# EAGLE design Radio Shack Drums (EAGLE 9.4.2)
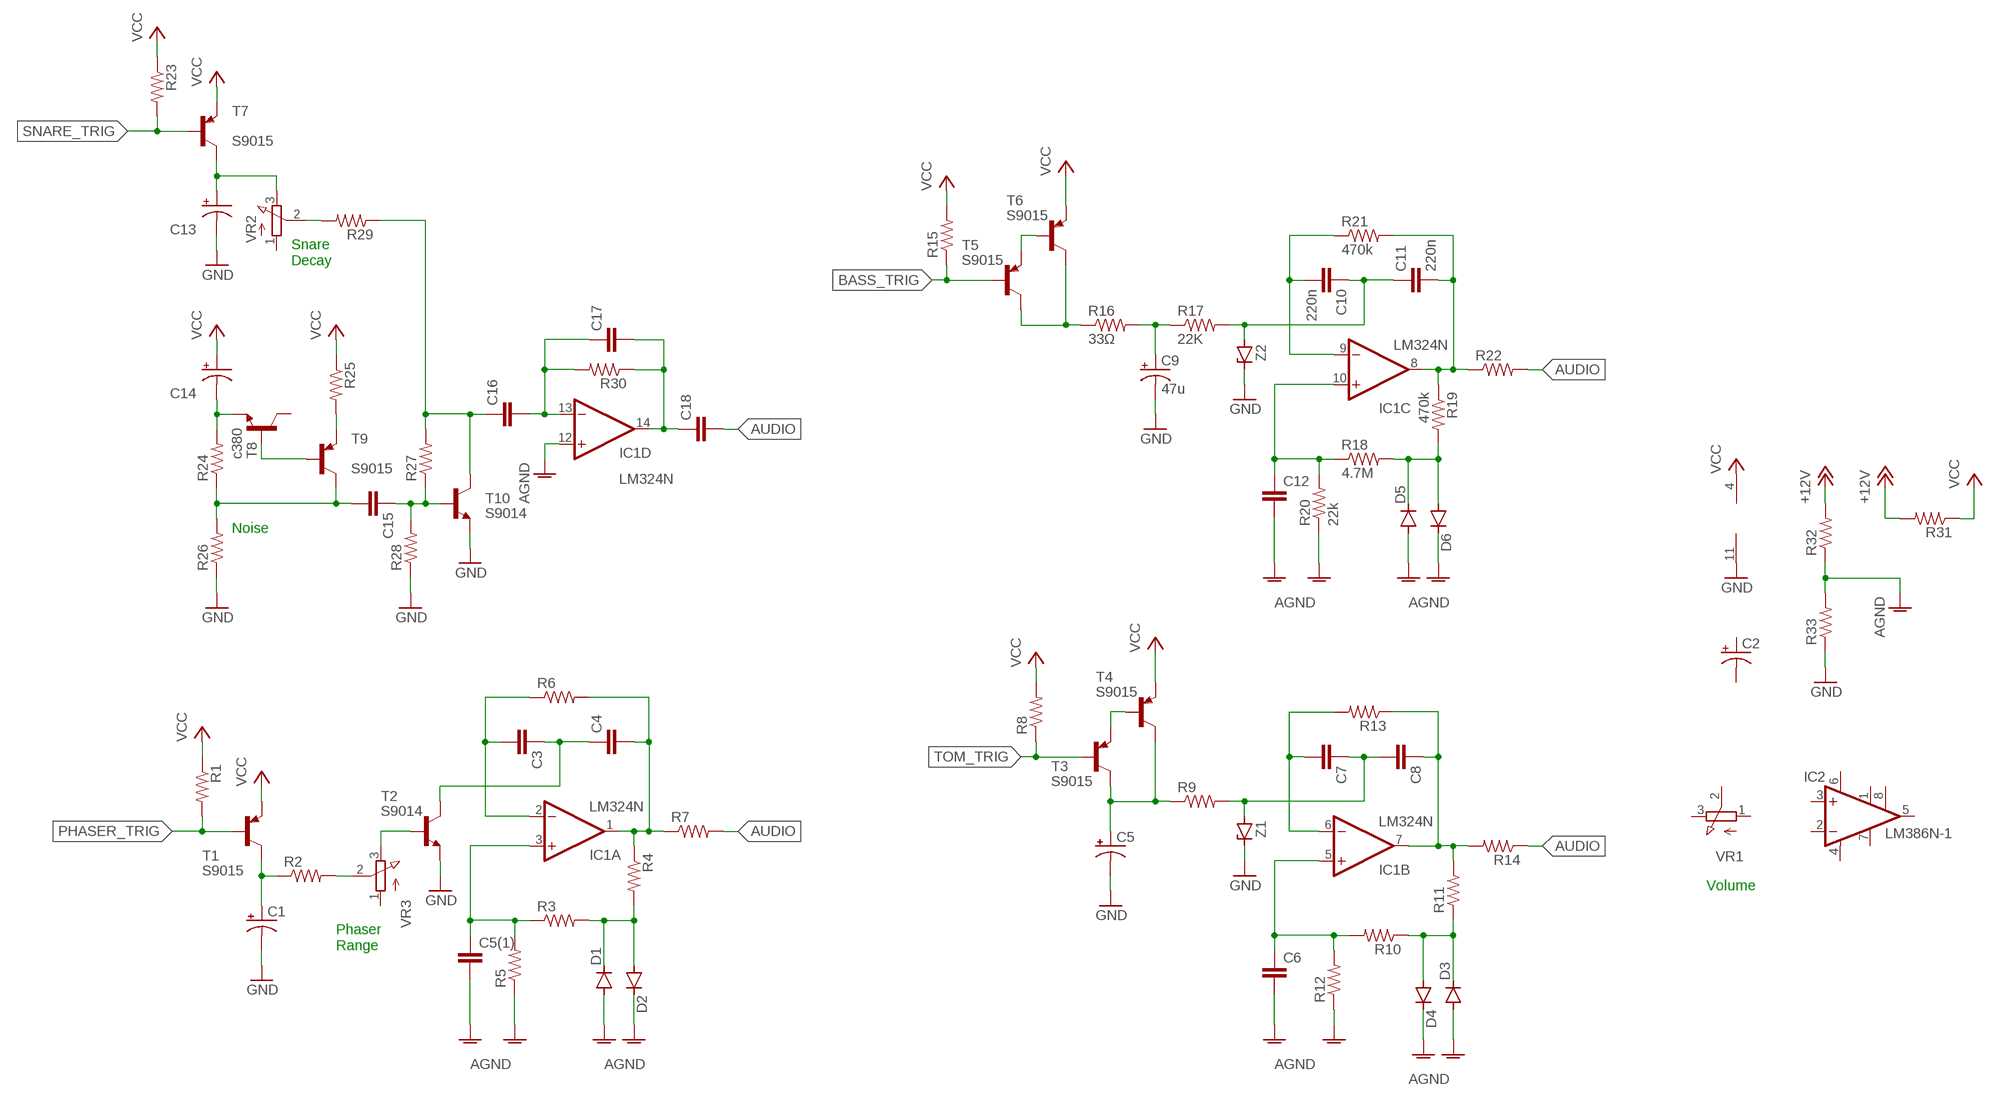
[diagram p0: schematic, sheet 1]

## Parts
C1  CPOL-USTT2D4L  [TT2D4L]
C2  CPOL-USTT2D4L  [TT2D4L]
C3  C-EU075-032X103  [C075-032X103]
C4  C-EU075-032X103  [C075-032X103]
C5  CPOL-USTT2D4L  [TT2D4L]
C5(1)  C-EU075-032X103  [C075-032X103]
C6  C-EU075-032X103  [C075-032X103]
C7  C-EU075-032X103  [C075-032X103]
C8  C-EU075-032X103  [C075-032X103]
C9  47u  CPOL-USTT2D4L  [TT2D4L]
C10  220n  C-EU075-032X103  [C075-032X103]
C11  220n  C-EU075-032X103  [C075-032X103]
C12  C-EU075-032X103  [C075-032X103]
C13  CPOL-USTT2D4L  [TT2D4L]
C14  CPOL-USTT2D4L  [TT2D4L]
C15  C-EU075-032X103  [C075-032X103]
C16  C-EU075-032X103  [C075-032X103]
C17  C-EU050-024X044  [C050-024X044]
C18  C-EU050-024X044  [C050-024X044]
D1  DIODE-D-5  [D-5]
D2  DIODE-D-5  [D-5]
D3  DIODE-D-5  [D-5]
D4  DIODE-D-5  [D-5]
D5  DIODE-D-5  [D-5]
D6  DIODE-D-5  [D-5]
IC1  LM324N  [DIL14]
IC2  LM386N-1  [DIL08]
R1  R-US_0207/10  [0207/10]
R2  R-US_0207/10  [0207/10]
R3  R-US_0207/10  [0207/10]
R4  R-US_0207/10  [0207/10]
R5  R-US_0207/10  [0207/10]
R6  R-US_0207/10  [0207/10]
R7  R-US_0207/10  [0207/10]
R8  R-US_0207/10  [0207/10]
R9  R-US_0207/10  [0207/10]
R10  R-US_0207/10  [0207/10]
R11  R-US_0207/10  [0207/10]
R12  R-US_0207/10  [0207/10]
R13  R-US_0207/10  [0207/10]
R14  R-US_0207/10  [0207/10]
R15  R-US_0207/10  [0207/10]
R16  33Ω  R-US_0207/10  [0207/10]
R17  22K  R-US_0207/10  [0207/10]
R18  4.7M  R-US_0207/10  [0207/10]
R19  470k  R-US_0207/10  [0207/10]
R20  22k  R-US_0207/10  [0207/10]
R21  470k  R-US_0207/10  [0207/10]
R22  R-US_0207/10  [0207/10]
R23  R-US_0207/10  [0207/10]
R24  R-US_0207/10  [0207/10]
R25  R-US_0207/10  [0207/10]
R26  R-US_0207/10  [0207/10]
R27  R-US_0207/10  [0207/10]
R28  R-US_0207/10  [0207/10]
R29  R-US_0207/10  [0207/10]
R30  R-US_0207/10  [0207/10]
R31  R-US_0207/10  [0207/10]
R32  R-US_0207/10  [0207/10]
R33  R-US_0207/10  [0207/10]
T1  S9015  -PNP-TO92  [TO92]
T2  S9014  -NPN-TO92  [TO92]
T3  S9015  -PNP-TO92  [TO92]
T4  S9015  -PNP-TO92  [TO92]
T5  S9015  -PNP-TO92  [TO92]
T6  S9015  -PNP-TO92  [TO92]
T7  S9015  -PNP-TO92  [TO92]
T8  c380  -NPN-TO92-ECB  [TO92-ECB]
T9  S9015  -PNP-TO92  [TO92]
T10  S9014  -NPN-TO92  [TO92]
VR1  3RP/1610N  [3RP/1610N]
VR2  3RP/1610N  [3RP/1610N]
VR3  3RP/1610N  [3RP/1610N]
Z1  ZENER-DIODEDO34-7  [DO34Z7]
Z2  ZENER-DIODEDO34-7  [DO34Z7]

## Nets
+12V: R31.2 R32.2
AGND: C5(1).2 C6.2 C12.2 D1.A D2.C D3.A D4.C D5.A D6.C IC1.12(D:+IN) R5.1 R12.1 R20.1 R32.1 R33.2
AUDIO: C18.2 R7.2 R14.1 R22.2
BASS_TRIG: R15.1 T5.2(B)
GND: C1.- C5.- C9.- C13.- IC1.11(P:V-) R26.1 R28.1 R33.1 T2.1(E) T10.1(E) Z1.C Z2.C
N$1: T2.2(B) VR3.3(E)
N$2: R2.2 VR3.2(S)
N$3: C1.+ R2.1 T1.3(C)
N$4: C3.1 C4.1 T2.3(C)
N$5: C3.2 IC1.2(A:-IN) R6.1
N$6: C4.2 IC1.1(A:OUT) R4.1 R6.2 R7.1
N$7: D1.C D2.A R3.2 R4.2
N$8: C6.1 IC1.5(B:+IN) R10.2 R12.2
N$9: C5(1).1 IC1.3(A:+IN) R3.1 R5.2
N$10: D3.C D4.A R10.1 R11.1
N$11: C7.1 C8.2 R9.2 Z1.A
N$12: C7.2 IC1.6(B:-IN) R13.2
N$13: C8.1 IC1.7(B:OUT) R11.2 R13.1 R14.2
N$14: T5.1(E) T6.2(B)
N$15: R16.1 T5.3(C) T6.3(C)
N$16: T3.1(E) T4.2(B)
N$17: C5.+ R9.1 T3.3(C) T4.3(C)
N$18: C15.2 R24.1 R26.2 T9.3(C)
N$19: C9.+ R16.2 R17.1
N$20: C10.1 C11.1 R17.2 Z2.A
N$21: C10.2 IC1.9(C:-IN) R21.1
N$22: C11.2 IC1.8(C:OUT) R19.1 R21.2 R22.1
N$23: C12.1 IC1.10(C:+IN) R18.1 R20.2
N$24: D5.C D6.A R18.2 R19.2
N$25: C13.+ T7.3(C) VR2.3(E)
N$26: R29.2 VR2.2(S)
N$27: C17.2 C18.1 IC1.14(D:OUT) R30.1
N$28: C14.- R24.2 T8.E
N$29: R25.2 T9.1(E)
N$30: C15.1 R27.1 R28.2 T10.2(B)
N$31: C16.1 R27.2 R29.1 T10.3(C)
N$32: T8.B T9.2(B)
N$33: C16.2 C17.1 IC1.13(D:-IN) R30.2
PHASER_TRIG: R1.2 T1.2(B)
SNARE_TRIG: R23.2 T7.2(B)
TOM_TRIG: R8.1 T3.2(B)
VCC: C14.+ IC1.4(P:V+) R1.1 R8.2 R15.2 R23.1 R25.1 R31.1 T1.1(E) T4.1(E) T6.1(E) T7.1(E)
Unconnected: C2.+ C2.- IC2.1(GAIN) IC2.2(-IN) IC2.3(+IN) IC2.5(OUT) IC2.7(BYPASS) IC2.8(GAIN) T8.C VR1.1(A) VR1.2(S) VR1.3(E) VR2.1(A) VR3.1(A)

## Notes on the sheet
- Snare
  Decay
- Noise
- Volume
- Phaser
  Range

## Power pins joined to a net without a drawn wire
GND: IC2.4(GND)
VS: IC2.6(VS)

## Library data of the parts
C1 C2 C5 C9 C13 C14 = rcl:CPOL-US: POLARIZED CAPACITOR, American symbol; SPICEPREFIX: C
C3 C4 C5(1) C6-C8 C10-C12 C15-C18 = rcl:C-EU: CAPACITOR, European symbol; SPICEPREFIX: C
D1-D6 = diode:DIODE-: DIODE
IC1 = linear:LM324: OP AMP
IC2 = linear:LM386?-*: Low Voltage Audio Power Amplifier Source: http://cache.national.com/ds/LM/LM386.pdf
R1-R33 = rcl:R-US_: RESISTOR, American symbol; SPICEPREFIX: R
T1 T3-T7 T9 = transistor:*-PNP-: PNP Transistror
T2 T8 T10 = transistor:*-NPN-: NPN Transistror BF959 corrected 2008.03.06
VR1-VR3 = pot:3RP/1610N: 16mm Potentiometer one level Source: http://www.alphapotentiometers.net/html/16mm_pot_2.html
Z1 Z2 = diode:ZENER-DIODE: Z-Diode

## Board
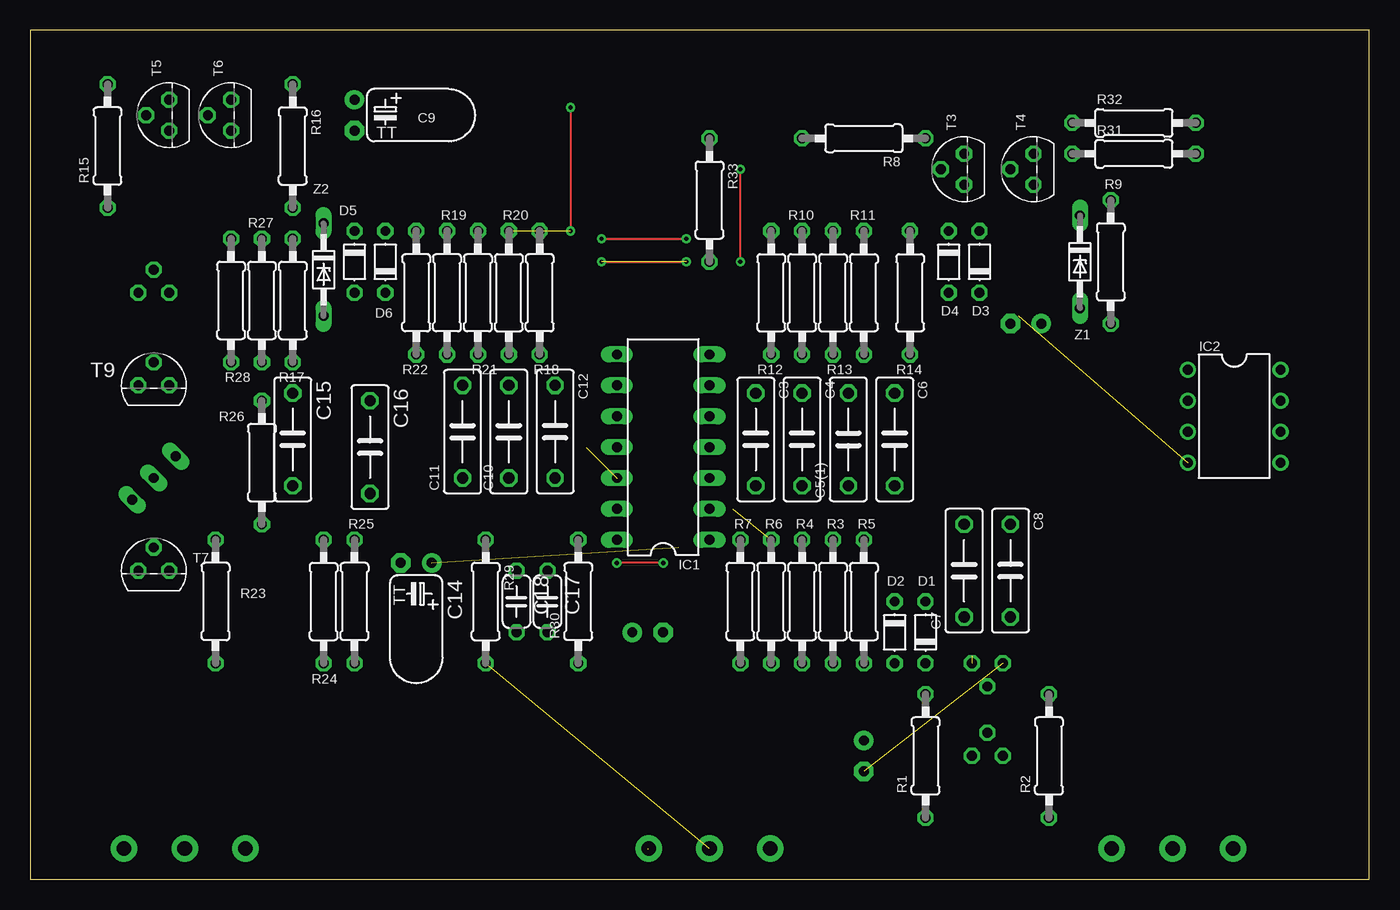
[diagram p1: board, top side]
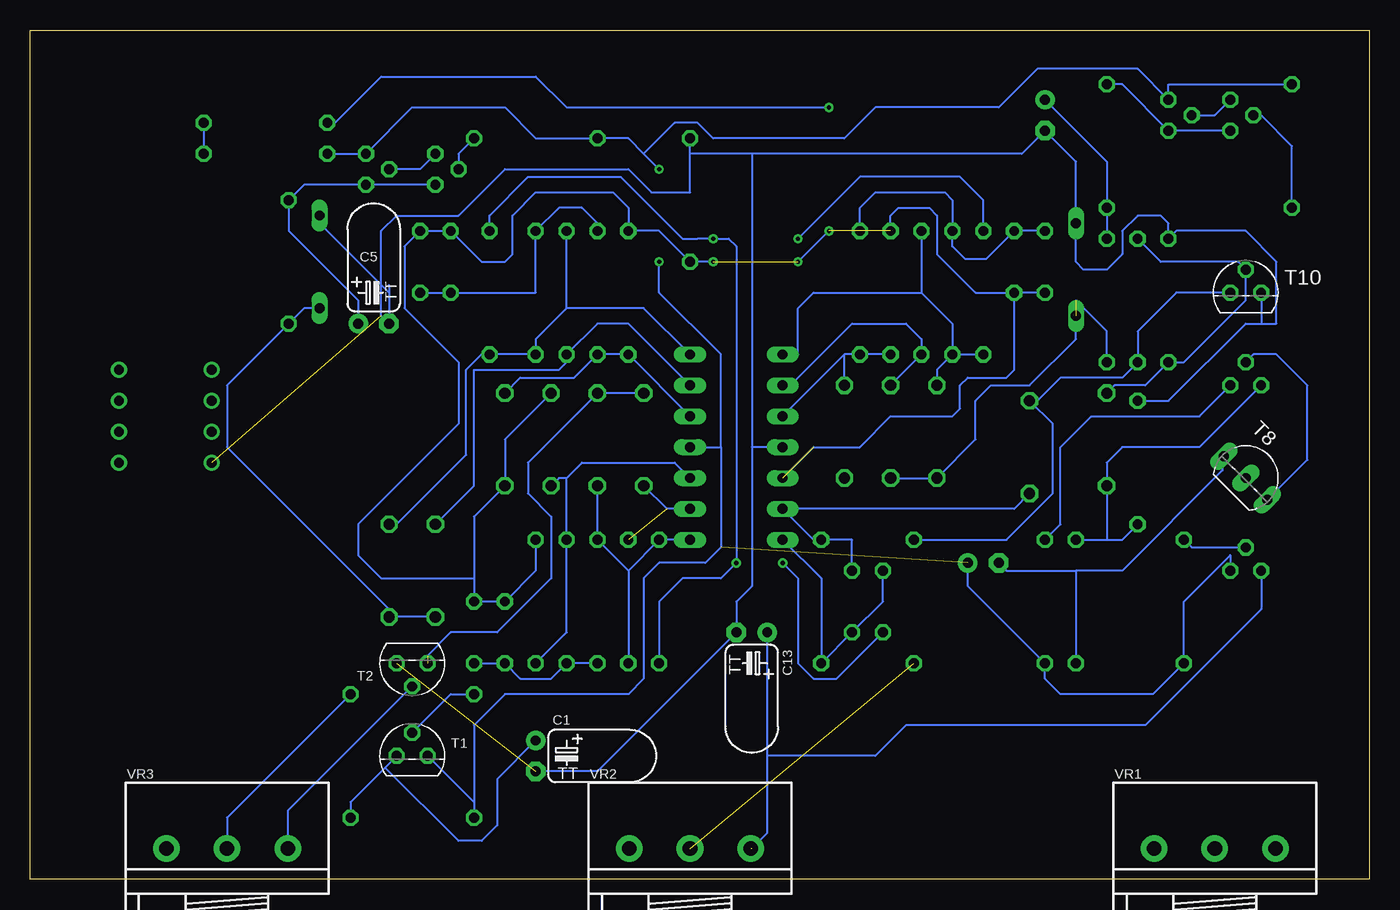
[diagram p2: board, bottom side, seen from below]

Size 110.16 x 69.84 mm. Coordinates in mm from the lower left corner, seen from the top.
Outline: 0,0 110.16,0 110.16,69.84 0,69.84 0,0
Copper layers (1*16): Top 0.035mm / dielectric 1.5mm / Bottom 0.035mm
Design rules "default": minimum track width 6mil, minimum drill 0.35mm, track to track 6mil, track to pad 6mil, pad to pad 6mil, via to via 6mil, smd to smd 6mil, copper to edge 40mil, drill to drill 6mil, minimum pad ring 10mil, minimum via ring 8mil, stop-mask expansion 4mil, vias tented up to drill 0mil, thermal gap 10mil

### Footprints (pad centres in the part's own frame; a part is rotated, then mirrored left to right if it is on the bottom)
TT2D4L = drill 0.813 pad 1.6: + -1.27,0 | drill 0.813 pad 1.6 octagon: - 1.27,0
C075-032X103 = drill 0.914 octagon: 1 -3.81,0; 2 3.81,0
C050-024X044 = drill 0.813 octagon: 1 -2.54,0; 2 2.54,0
D-5 = drill 0.813 octagon: A 2.54,0; C -2.54,0
DIL14 = drill 0.813 long: 1 -7.62,-3.81; 2 -5.08,-3.81; 3 -2.54,-3.81; 4 0,-3.81; 5 2.54,-3.81; 6 5.08,-3.81; 7 7.62,-3.81; 8 7.62,3.81; 9 5.08,3.81; 10 2.54,3.81; 11 0,3.81; 12 -2.54,3.81; 13 -5.08,3.81; 14 -7.62,3.81
DIL08 = drill 0.813 pad 1.27: 1 -3.81,-3.81; 2 -1.27,-3.81; 3 1.27,-3.81; 4 3.81,-3.81; 5 3.81,3.81; 6 1.27,3.81; 7 -1.27,3.81; 8 -3.81,3.81
0207/10 = drill 0.813 octagon: 1 -5.08,0; 2 5.08,0
TO92 = drill 0.813 octagon: 1 1.27,0; 2 0,1.905; 3 -1.27,0
TO92-ECB = drill 0.813 long: B 2.54,0; C 0,0; E -2.54,0
3RP/1610N = drill 1.2 pad 2.184: 1 -5,0; 2 0,0; 3 5,0
DO34Z7 = drill 0.813 long: A 3.81,0; C -3.81,0

### Placement (x,y rotation side)
C1  68.58,10.16 270 bottom
C2  -58.42,-10.16 0 top  (outside the outline)
C3  59.69,36.2 270 top
C4  63.5,36.2 270 top
C5  81.92,45.72 0 bottom
C5(1)  67.31,36.2 90 top
C6  71.12,36.2 270 top
C7  76.83,25.4 90 top
C8  80.64,25.4 270 top
C9  26.67,62.87 270 top
C10  39.37,36.83 90 top
C11  35.56,36.83 90 top
C12  43.18,36.83 270 top
C13  50.8,20.32 180 bottom
C14  31.75,26.04 180 top
C15  21.59,36.2 270 top
C16  27.94,35.56 270 top
C17  42.55,22.86 270 top
C18  40.01,22.86 270 top
D1  73.66,20.32 90 top
D2  71.12,20.32 270 top
D3  78.11,50.8 90 top
D4  75.56,50.8 270 top
D5  26.67,50.8 270 top
D6  29.21,50.8 90 top
IC1  52.07,35.56 90 top
IC2  99.06,38.1 270 top
R1  73.66,10.16 90 top
R2  83.82,10.16 90 top
R3  66.04,22.86 270 top
R4  63.5,22.86 270 top
R5  68.58,22.86 270 top
R6  60.96,22.86 270 top
R7  58.42,22.86 270 top
R8  68.58,60.96 180 top
R9  88.9,50.8 270 top
R10  63.5,48.26 270 top
R11  68.58,48.26 270 top
R12  60.96,48.26 270 top
R13  66.04,48.26 270 top
R14  72.39,48.26 270 top
R15  6.35,60.32 90 top
R16  21.59,60.32 270 top
R17  21.59,47.62 270 top
R18  41.91,48.26 90 top
R19  34.29,48.26 90 top
R20  39.37,48.26 270 top
R21  36.83,48.26 90 top
R22  31.75,48.26 90 top
R23  15.24,22.86 90 top
R24  24.13,22.86 270 top
R25  26.67,22.86 90 top
R26  19.05,34.29 270 top
R27  19.05,47.62 270 top
R28  16.51,47.62 270 top
R29  37.47,22.86 270 top
R30  45.09,22.86 90 top
R31  90.81,59.69 0 top
R32  90.81,62.23 0 top
R33  55.88,55.88 270 top
T1  78.74,10.16 0 bottom
T2  78.74,17.78 180 bottom
T3  76.83,58.42 90 top
T4  82.55,58.42 90 top
T5  11.43,62.87 90 top
T6  16.51,62.87 90 top
T7  10.16,25.4 0 top
T8  10.16,33.02 315 bottom
T9  10.16,40.64 0 top
T10  10.16,48.26 0 bottom
VR1  12.7,2.54 0 bottom
VR2  55.88,2.54 0 bottom
VR3  93.98,2.54 0 bottom
Z1  86.36,50.8 270 top
Z2  24.13,50.16 270 top

### Tracks (layer width: path | path; a pad name or v marks a point on that pad's centre or on a via)
+12V
  Bottom 0.152: R32.2 R31.2
AGND  (via drill 0.35)  (3 unrouted)
  Top 0.152: v44.45,63.5 v44.45,53.34 | v46.99,50.8 v53.98,50.8
  Bottom 0.152: R5.1 68.58,25.4 D2.C D1.A | C5(1).2 71.12,36.2 C6.2 73.66,29.84 D1.A | D1.A 73.66,24.77 81.28,24.77 83.19,26.67 83.19,29.21 74.93,37.46 74.93,42.55 79.38,46.99 79.38,52.07 D3.A D4.C 73.03,50.8 71.12,50.8 70.48,51.44 70.48,54.61 68.58,56.52 62.23,56.52 60.96,55.24 R12.1 58.42,53.34 R33.2 v53.98,50.8 | R32.1 85.09,62.23 81.28,66.04 68.58,66.04 66.04,63.5 v44.45,63.5 | v44.45,53.34 v46.99,50.8 | D5.A D6.C | D6.C 32.38,48.26 35.56,51.44 35.56,54.61 36.2,55.24 38.73,55.24 39.37,54.61 R20.1 | IC1.12 45.72,35.56 41.91,35.56 39.37,38.1 34.29,38.1 33.66,38.73 33.66,40.64 33.02,41.27 29.84,41.27 29.21,41.91 D6.C
AUDIO  (via drill 0.35)
  Top 0.152: v52.07,26.04 v48.26,26.04 | v46.99,52.7 v53.98,52.7
  Bottom 0.152: R14.1 72.39,54.61 69.22,57.78 61.59,57.78 56.52,52.7 55.24,52.7 v53.98,52.7 52.7,52.7 52.07,52.07 v52.07,26.04 53.34,24.77 56.52,24.77 58.42,22.86 R7.2 | v48.26,26.04 46.99,24.77 46.99,17.78 45.72,16.51 43.81,16.51 C18.2 | R22.2 31.75,55.88 33.66,57.78 41.91,57.78 v46.99,52.7
BASS_TRIG
  Bottom 0.152: R15.1 6.35,60.32 8.89,62.87 T5.2
GND  (2 unrouted)
  Bottom 0.152: 80.64,48.89 80.64,48.26 | 80.64,48.26 C5.- 81.28,46.35 81.28,53.34 80.01,54.61 74.93,54.61 71.12,58.42 60.96,58.42 59.05,56.52 55.88,56.52 55.88,59.69 | IC1.11 50.8,35.56 | 50.8,59.69 50.8,35.56 | 50.8,59.69 55.88,59.69 | 55.88,59.69 R33.1 | R26.1 16.51,39.37 10.16,45.72 8.89,45.72 | 8.89,45.72 7.62,45.72 7.62,50.8 10.16,53.34 15.88,53.34 R28.1 16.51,53.98 17.14,54.61 19.05,54.61 20.32,53.34 20.32,51.44 21.59,50.16 23.5,50.16 24.13,50.8 Z2.C 24.13,59.05 C9.- 28.57,59.69 50.8,59.69 | T10.1 8.89,45.72 | 80.64,48.26 86.36,53.98 Z1.C | 50.8,35.56 50.8,24.13 52.07,22.86 C13.- 63.5,8.89 C1.-
N$1
  Bottom 0.152: VR3.3 88.98,5.63 T2.2
N$2
  Bottom 0.152: R2.2 93.98,5.08 VR3.2
N$3
  Bottom 0.152: R2.1 83.82,6.35 80.96,9.21 | T1.3 80.96,9.21 | C1.+ 71.75,8.25 71.75,4.45 73.03,3.17 74.93,3.17 80.96,9.21
N$4  (1 unrouted)
  Bottom 0.152: C3.1 C4.1 69.22,34.29 69.22,31.75 67.31,29.84 67.31,24.77 71.75,20.32 75.56,20.32 77.47,18.41
N$5  (1 unrouted)
  Bottom 0.152: IC1.2 57.78,30.48 C3.2
N$6
  Bottom 0.152: IC1.1 R7.1 60.96,25.4 | 60.96,25.4 R6.2 | 60.96,25.4 R4.1 C4.2
N$7
  Bottom 0.152: R4.2 R3.2 67.31,16.51 69.85,16.51 D2.A D1.C
N$8
  Bottom 0.152: IC1.5 R12.2 R10.2 65.41,41.27 69.85,41.27 C6.1
N$9
  Bottom 0.152: 66.04,33.02 R3.1 66.04,20.32 R5.2 | 66.04,33.02 64.77,34.29 57.15,34.29 IC1.3 | 66.04,33.02 66.67,33.02 C5(1).1
N$10
  Bottom 0.152: R10.1 63.5,53.98 64.77,55.24 66.67,55.24 R11.1 68.58,48.26 D4.A D3.C
N$11
  Bottom 0.152: C7.1 C8.2 80.64,22.22 93.98,35.56 93.98,40.64 R9.2 87.63,46.99 Z1.A
N$12
  Bottom 0.152: IC1.6 60.96,45.72 63.5,45.72 R13.2 66.04,42.55 66.67,41.91 73.66,41.91 73.66,32.38 C7.2
N$13
  Bottom 0.152: IC1.7 59.69,46.99 66.04,46.99 | 66.04,46.99 R13.1 | 66.04,46.99 68.58,44.45 R11.2 R14.2 73.03,43.18 74.3,41.91 74.3,34.92 80.01,29.21 C8.1
N$14
  Bottom 0.152: T6.2 12.7,62.87 T5.1
N$15
  Bottom 0.152: T5.3 T6.3 20.32,65.41 R16.1
N$16
  Bottom 0.152: T3.1 78.11,58.42 T4.2
N$17
  Bottom 0.152: T3.3 T4.3 87.63,57.15 R9.1 88.9,53.34 83.19,47.62 C5.+
N$18
  Bottom 0.152: R24.1 21.59,27.94 | 21.59,27.94 20.32,27.94 R26.2 | 21.59,27.94 C15.2 21.59,34.29 20.32,35.56 13.97,35.56 T9.3
N$19
  Bottom 0.152: C9.+ 21.59,59.05 R16.2 R17.1
N$20  (1 unrouted)
  Bottom 0.152: C10.1 C11.1 32.38,36.2 32.38,39.37 31.11,40.64 27.94,40.64 24.13,44.45 Z2.A | R17.2 21.59,45.09 24.13,47.62
N$21
  Bottom 0.152: IC1.9 47.62,40.64 42.55,45.72 38.1,45.72 36.83,44.45 R21.1 C10.2
N$22
  Bottom 0.152: IC1.8 46.99,43.18 46.99,46.99 45.72,48.26 36.83,48.26 | R19.1 R22.1 | R21.2 36.83,48.26 | 36.83,48.26 34.29,45.72 R19.1 | R19.1 35.56,41.91 C11.2
N$23
  Bottom 0.152: R20.2 R18.1 43.18,43.18 | IC1.10 43.18,43.18 | C12.1 43.18,43.18
N$24
  Bottom 0.152: D5.C D6.A 31.53,51.02 33.24,51.02 34.29,52.07 R19.2 34.29,55.88 34.92,56.52 40.64,56.52 41.91,55.24 R18.2
N$25  (1 unrouted)
  Bottom 0.152: 50.8,2.54 49.53,3.81 49.53,10.16 | C13.+ 49.53,10.16 | T7.3 8.89,22.22 18.41,12.7 38.1,12.7 40.64,10.16 49.53,10.16
N$26  (1 unrouted)
N$27
  Bottom 0.152: IC1.14 45.09,24.77 R30.1 C17.2 40.01,22.86 C18.1
N$28
  Bottom 0.152: C14.- 29.84,25.4 24.13,25.4 | 24.13,25.4 R24.2 | T8.E 12.06,34.71 12.06,33.66 20.32,25.4 24.13,25.4
N$29
  Bottom 0.152: R25.2 25.4,29.21 25.4,35.56 22.86,38.1 13.97,38.1 T9.1
N$30
  Bottom 0.152: C15.1 20.95,40.64 18.41,40.64 R28.2 15.24,42.55 10.16,47.62 T10.2 10.16,50.18 10.78,50.8 17.14,50.8 R27.1
N$31
  Bottom 0.152: T10.3 15.88,48.26 19.05,45.09 R27.2 20.32,41.27 25.4,41.27 27.3,39.37 C16.1 26.04,37.46 26.04,31.75 29.84,27.94 R29.1
N$32
  Bottom 0.152: T8.B 5.08,34.51 5.08,40.64 7.62,43.18 9.53,43.18 T9.2
N$33
  Bottom 0.152: C16.2 29.21,30.48 IC1.13 45.72,27.94 R30.2 42.55,27.94 C17.1
PHASER_TRIG
  Bottom 0.152: R1.2 75.56,15.24 T1.2
SNARE_TRIG
  Bottom 0.152: R23.2 14.61,27.3 T7.2
TOM_TRIG
  Bottom 0.152: R8.1 74.93,59.69 T3.2
VCC  (via drill 0.35)  (1 unrouted)
  Top 0.152: v58.42,50.8 v58.42,58.42
  Bottom 0.152: T1.1 73.66,6.35 R1.1 73.66,12.7 71.12,15.24 60.96,15.24 59.69,16.51 59.69,24.77 58.42,26.04 54.61,26.04 53.34,27.3 53.34,35.56 | 53.34,35.56 53.34,43.18 58.42,48.26 v58.42,50.8 | v58.42,58.42 59.69,59.69 | 59.69,59.69 60.96,60.96 R8.2 68.58,60.96 71.12,63.5 78.74,63.5 T4.1 R31.1 | R15.2 16.51,65.41 T6.1 19.05,66.68 27.3,66.68 30.48,63.5 40.64,63.5 43.18,60.96 53.98,60.96 55.24,62.23 57.15,62.23 59.69,59.69 | T7.1 11.43,26.67 15.24,22.86 R23.1 17.78,15.24 25.4,15.24 26.67,16.51 R25.1 33.02,24.13 C14.+ | IC1.4 53.34,35.56